# Altium schematic sheet CPU.SchDoc: Motherboard-CPU
size A3; Author: Patryk Bujak; DrawnBy: Patryk Bujak; Revision: 1.0; SheetNumber: 3; SheetTotal: 10
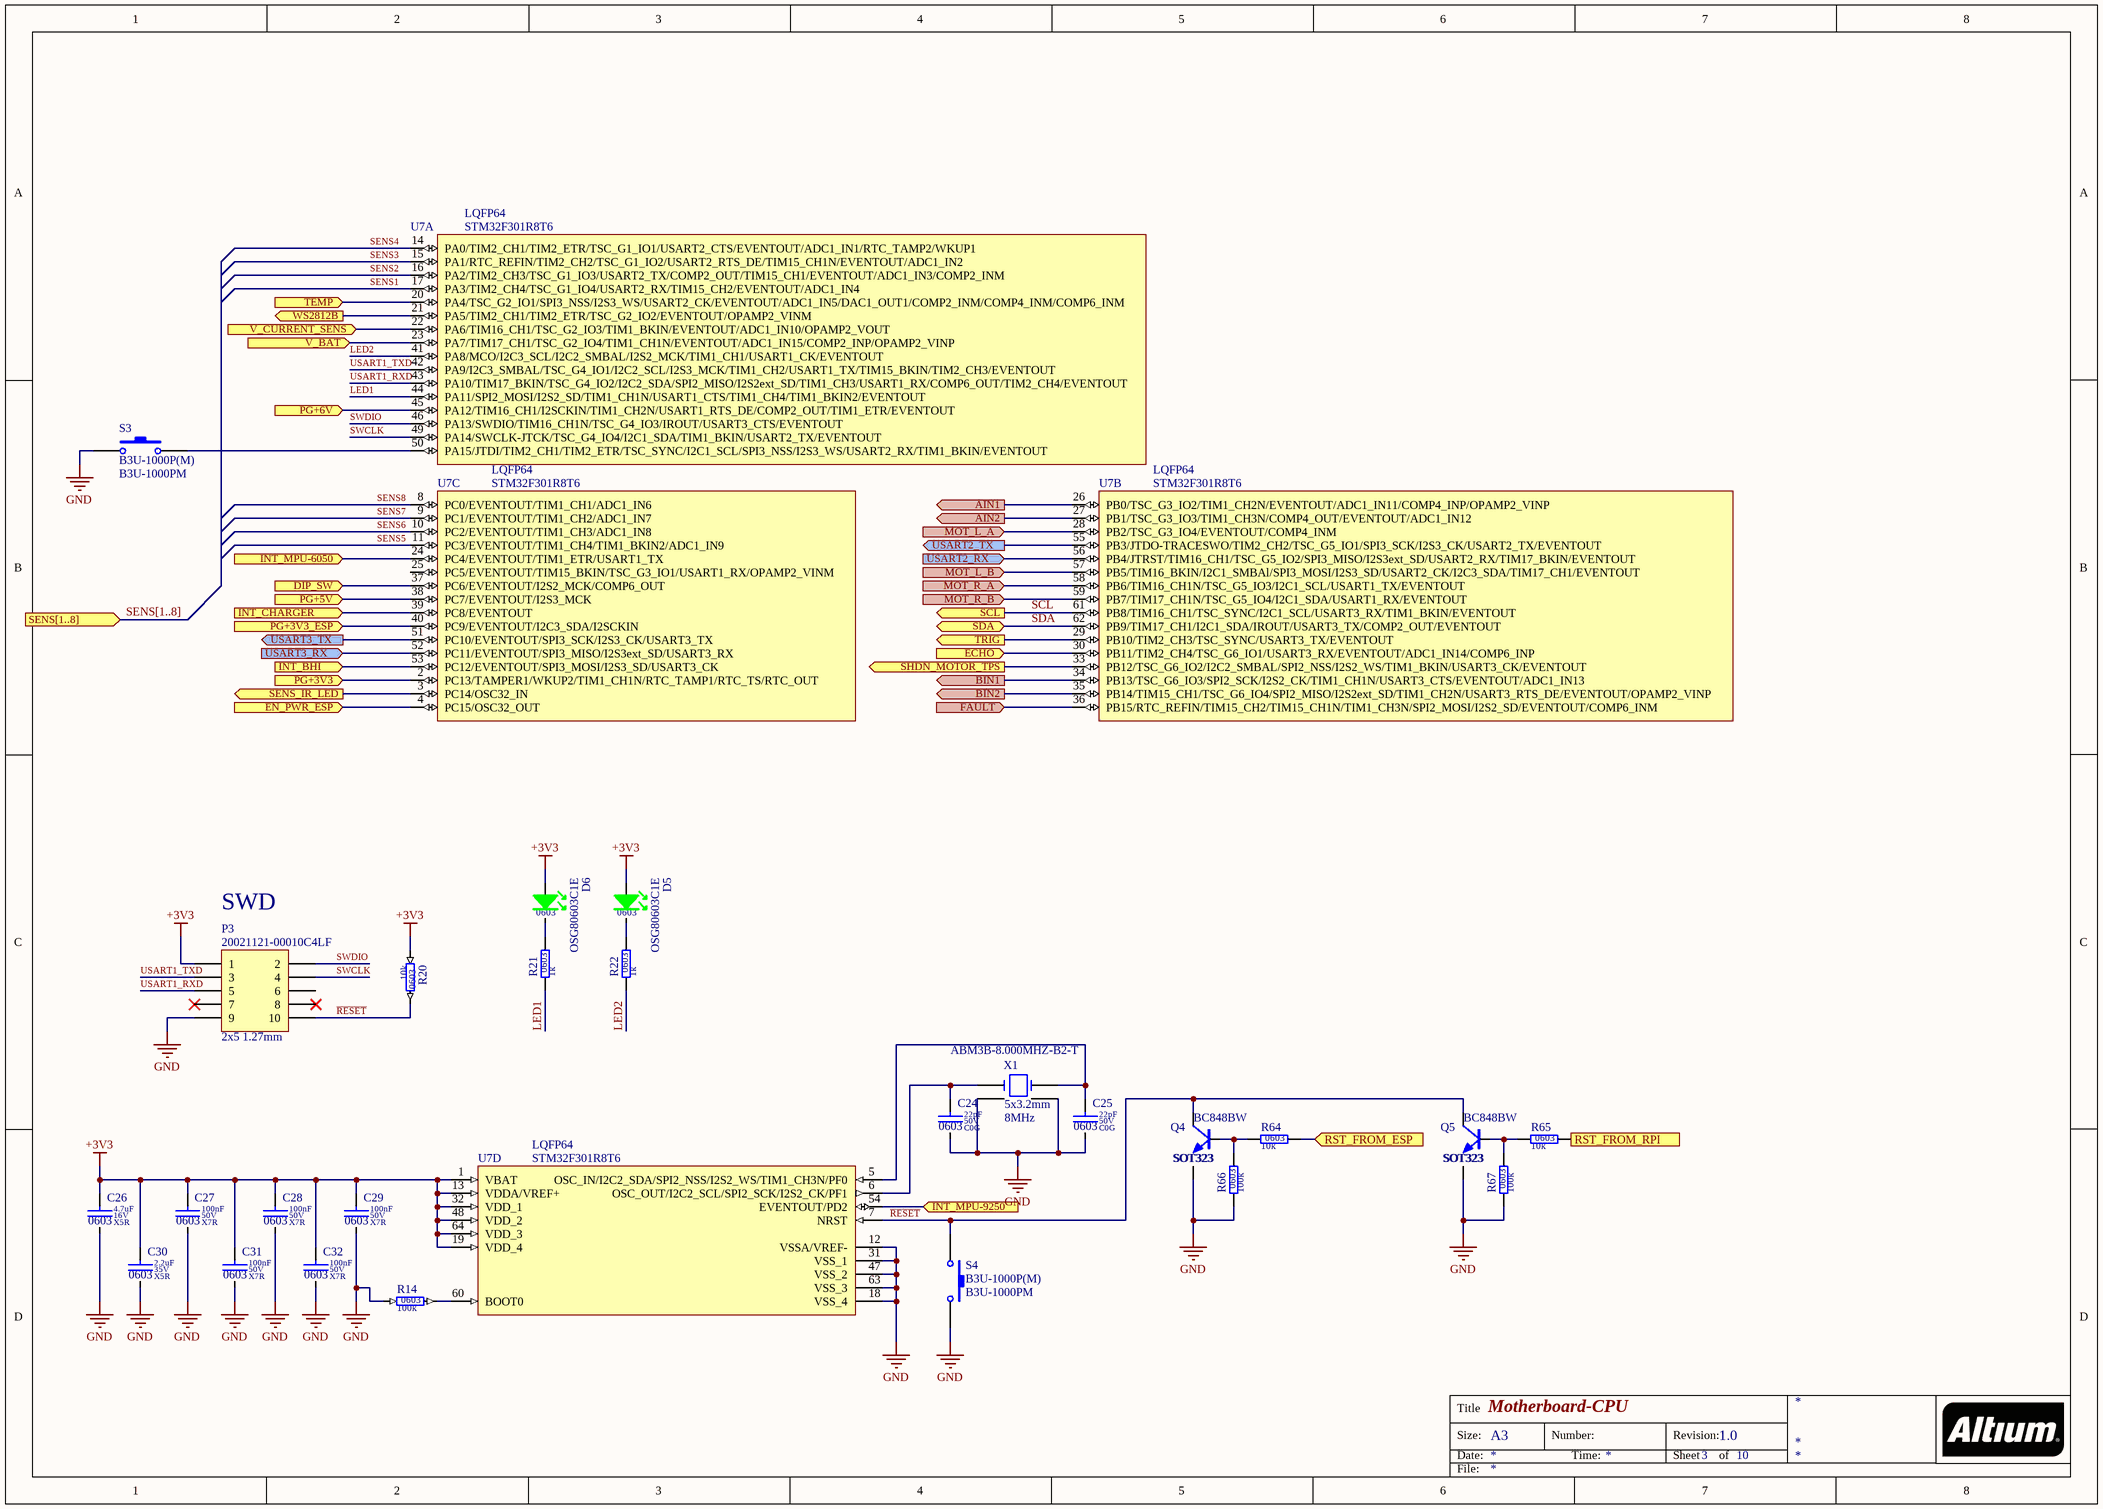
[diagram p0: CPU.SchDoc]

## Parts
C24  value 22pF  Dielectric: C0G  Voltage: 50V  SCH_Footprint: 0603  [C_0603_1608]  (hidden comment: Ceramic C0G)
C25  value 22pF  Dielectric: C0G  Voltage: 50V  SCH_Footprint: 0603  [C_0603_1608]  (hidden comment: Ceramic C0G)
C26  value 4.7uF  Dielectric: X5R  Voltage: 16V  SCH_Footprint: 0603  [C_0603_1608]  (hidden comment: Ceramic X5R)
C27  value 100nF  Dielectric: X7R  Voltage: 50V  SCH_Footprint: 0603  [C_0603_1608]  (hidden comment: Ceramic X7R)
C28  value 100nF  Dielectric: X7R  Voltage: 50V  SCH_Footprint: 0603  [C_0603_1608]  (hidden comment: Ceramic X7R)
C29  value 100nF  Dielectric: X7R  Voltage: 50V  SCH_Footprint: 0603  [C_0603_1608]  (hidden comment: Ceramic X7R)
C30  value 2.2uF  Dielectric: X5R  Voltage: 35V  SCH_Footprint: 0603  [C_0603_1608]  (hidden comment: Ceramic X5R)
C31  value 100nF  Dielectric: X7R  Voltage: 50V  SCH_Footprint: 0603  [C_0603_1608]  (hidden comment: Ceramic X7R)
C32  value 100nF  Dielectric: X7R  Voltage: 50V  SCH_Footprint: 0603  [C_0603_1608]  (hidden comment: Ceramic X7R)
D5  value OSG80603C1E  SCH_Footprint: 0603  [OL_0603_1608]  (hidden comment: Green led)
D6  value OSG80603C1E  SCH_Footprint: 0603  [OL_0603_1608]  (hidden comment: Green led)
P3  value 20021121-00010C4LF  SCH_Footprint: 2x5 1.27mm  [P_HEADER_2x5_1.27]  (hidden comment: Jtag)
Q4  SCH_Footprint: SOT323  [SOT323_SC70]  (hidden comment: BC848BW)
Q5  SCH_Footprint: SOT323  [SOT323_SC70]  (hidden comment: BC848BW)
R14  value 100k  SCH_Footprint: 0603  [R_0603_1608]  (hidden comment: Resistor)
R20  value 10k  SCH_Footprint: 0603  [R_0603_1608]  (hidden comment: Resistor)
R21  value 1k  SCH_Footprint: 0603  [R_0603_1608]  (hidden comment: Resistor)
R22  value 1k  SCH_Footprint: 0603  [R_0603_1608]  (hidden comment: Resistor)
R64  value 10k  SCH_Footprint: 0603  [R_0603_1608]  (hidden comment: Resistor)
R65  value 10k  SCH_Footprint: 0603  [R_0603_1608]  (hidden comment: Resistor)
R66  value 100k  SCH_Footprint: 0603  [R_0603_1608]  (hidden comment: Resistor)
R67  value 100k  SCH_Footprint: 0603  [R_0603_1608]  (hidden comment: Resistor)
S3  value B3U-1000PM  SCH_Footprint: B3U-1000P(M)  [B3U-1000P]  (hidden comment: Ultra-small Tactile Switch)
S4  value B3U-1000PM  SCH_Footprint: B3U-1000P(M)  [B3U-1000P]  (hidden comment: Ultra-small Tactile Switch)
U7  SCH_Footprint: LQFP64  [LQFP64_10x10]  (hidden comment: STM32F301R8T6)  (parts A,B,C,D of 4)
X1  Manufacturer Part Number: ABM3B-8.000MHZ-B2-T  SCH_Footprint: 5x3.2mm  [X_ABM3B_5X3X11]  (hidden comment: 8MHz)

## Ports
AIN1 (out), AIN2 (out), BIN1 (out), BIN2 (out), DIP_SW (in), ECHO (in), EN_PWR_ESP (in), FAULT (in), INT_BHI (in), INT_CHARGER (in), INT_MPU-6050 (in), INT_MPU-9250 (in), MOT_L_A (in), MOT_L_B (in), MOT_R_A (in), MOT_R_B (in), PG+3V3 (in), PG+3V3_ESP (in), PG+5V (in), PG+6V (in), RST_FROM_ESP (in), RST_FROM_RPI (in), SCL (out), SDA (bidir), SENS[1..8] (in), SENS_IR_LED (out), SHDN_MOTOR_TPS (out), TEMP (in), TRIG (out), USART2_RX (in), USART2_TX (out), USART3_RX (in), USART3_TX (out), V_BAT (in), V_CURRENT_SENS (in), WS2812B (out)

## Nets
+3V3: C26.1 C27.1 C28.1 C29.1 C30.1 C31.1 C32.1 D5.2(A) D6.2(A) P3.1 R20.1 U7.1(VBAT) U7.13(VDDA/VREF+) U7.19(VDD_4) U7.32(VDD_1) U7.48(VDD_2) U7.64(VDD_3)
GND: C24.2 C25.2 C26.2 C27.2 C28.2 C29.2 C30.2 C31.2 C32.2 P3.9 Q4.2(E) Q5.2(E) R14.1 R66.1 R67.1 S3.1 S4.2 U7.12(VSSA/VREF-) U7.18(VSS_4) U7.31(VSS_1) U7.47(VSS_2) U7.63(VSS_3) X1.2(GND) X1.4(GND)
AIN1: U7.26(PB0/TSC_G3_IO2/TIM1_CH2N/EVENTOUT/ADC1_IN11/COMP4_INP/OPAMP2_VINP) ; port AIN1
AIN2: U7.27(PB1/TSC_G3_IO3/TIM1_CH3N/COMP4_OUT/EVENTOUT/ADC1_IN12) ; port AIN2
BIN1: U7.34(PB13/TSC_G6_IO3/SPI2_SCK/I2S2_CK/TIM1_CH1N/USART3_CTS/EVENTOUT/ADC1_IN13) ; port BIN1
BIN2: U7.35(PB14/TIM15_CH1/TSC_G6_IO4/SPI2_MISO/I2S2ext_SD/TIM1_CH2N/USART3_RTS_DE/EVENTOUT/OPAMP2_VINP) ; port BIN2
DIP_SW: U7.37(PC6/EVENTOUT/I2S2_MCK/COMP6_OUT) ; port DIP_SW
ECHO: U7.30(PB11/TIM2_CH4/TSC_G6_IO1/USART3_RX/EVENTOUT/ADC1_IN14/COMP6_INP) ; port ECHO
EN_PWR_ESP: U7.4(PC15/OSC32_OUT) ; port EN_PWR_ESP
FAULT: U7.36(PB15/RTC_REFIN/TIM15_CH2/TIM15_CH1N/TIM1_CH3N/SPI2_MOSI/I2S2_SD/EVENTOUT/COMP6_INM) ; port FAULT
INT_BHI: U7.53(PC12/EVENTOUT/SPI3_MOSI/I2S3_SD/USART3_CK) ; port INT_BHI
INT_CHARGER: U7.39(PC8/EVENTOUT) ; port INT_CHARGER
INT_MPU-6050: U7.24(PC4/EVENTOUT/TIM1_ETR/USART1_TX) ; port INT_MPU-6050
INT_MPU-9250: U7.54(EVENTOUT/PD2) ; port INT_MPU-9250
LED1: R21.1 U7.44(PA11/SPI2_MOSI/I2S2_SD/TIM1_CH1N/USART1_CTS/TIM1_CH4/TIM1_BKIN2/EVENTOUT)
LED2: R22.1 U7.41(PA8/MCO/I2C3_SCL/I2C2_SMBAL/I2S2_MCK/TIM1_CH1/USART1_CK/EVENTOUT)
MOT_L_A: U7.28(PB2/TSC_G3_IO4/EVENTOUT/COMP4_INM) ; port MOT_L_A
MOT_L_B: U7.57(PB5/TIM16_BKIN/I2C1_SMBAl/SPI3_MOSI/I2S3_SD/USART2_CK/I2C3_SDA/TIM17_CH1/EVENTOUT) ; port MOT_L_B
MOT_R_A: U7.58(PB6/TIM16_CH1N/TSC_G5_IO3/I2C1_SCL/USART1_TX/EVENTOUT) ; port MOT_R_A
MOT_R_B: U7.59(PB7/TIM17_CH1N/TSC_G5_IO4/I2C1_SDA/USART1_RX/EVENTOUT) ; port MOT_R_B
PG+3V3: U7.2(PC13/TAMPER1/WKUP2/TIM1_CH1N/RTC_TAMP1/RTC_TS/RTC_OUT) ; port PG+3V3
PG+3V3_ESP: U7.40(PC9/EVENTOUT/I2C3_SDA/I2SCKIN) ; port PG+3V3_ESP
PG+5V: U7.38(PC7/EVENTOUT/I2S3_MCK) ; port PG+5V
PG+6V: U7.45(PA12/TIM16_CH1/I2SCKIN/TIM1_CH2N/USART1_RTS_DE/COMP2_OUT/TIM1_ETR/EVENTOUT) ; port PG+6V
~{RESET}: P3.10 Q4.3(C) Q5.3(C) R20.2 S4.1 U7.7(NRST)
RST_FROM_ESP: R64.2 ; port RST_FROM_ESP
RST_FROM_RPI: R65.2 ; port RST_FROM_RPI
SCL: U7.61(PB8/TIM16_CH1/TSC_SYNC/I2C1_SCL/USART3_RX/TIM1_BKIN/EVENTOUT) ; port SCL
SDA: U7.62(PB9/TIM17_CH1/I2C1_SDA/IROUT/USART3_TX/COMP2_OUT/EVENTOUT) ; port SDA
SENS1: U7.17(PA3/TIM2_CH4/TSC_G1_IO4/USART2_RX/TIM15_CH2/EVENTOUT/ADC1_IN4)
SENS2: U7.16(PA2/TIM2_CH3/TSC_G1_IO3/USART2_TX/COMP2_OUT/TIM15_CH1/EVENTOUT/ADC1_IN3/COMP2_INM)
SENS3: U7.15(PA1/RTC_REFIN/TIM2_CH2/TSC_G1_IO2/USART2_RTS_DE/TIM15_CH1N/EVENTOUT/ADC1_IN2)
SENS4: U7.14(PA0/TIM2_CH1/TIM2_ETR/TSC_G1_IO1/USART2_CTS/EVENTOUT/ADC1_IN1/RTC_TAMP2/WKUP1)
SENS5: U7.11(PC3/EVENTOUT/TIM1_CH4/TIM1_BKIN2/ADC1_IN9)
SENS6: U7.10(PC2/EVENTOUT/TIM1_CH3/ADC1_IN8)
SENS7: U7.9(PC1/EVENTOUT/TIM1_CH2/ADC1_IN7)
SENS8: U7.8(PC0/EVENTOUT/TIM1_CH1/ADC1_IN6)
SENS_IR_LED: U7.3(PC14/OSC32_IN) ; port SENS_IR_LED
SHDN_MOTOR_TPS: U7.33(PB12/TSC_G6_IO2/I2C2_SMBAL/SPI2_NSS/I2S2_WS/TIM1_BKIN/USART3_CK/EVENTOUT) ; port SHDN_MOTOR_TPS
SWCLK: P3.4 U7.49(PA14/SWCLK-JTCK/TSC_G4_IO4/I2C1_SDA/TIM1_BKIN/USART2_TX/EVENTOUT)
SWDIO: P3.2 U7.46(PA13/SWDIO/TIM16_CH1N/TSC_G4_IO3/IROUT/USART3_CTS/EVENTOUT)
TEMP: U7.20(PA4/TSC_G2_IO1/SPI3_NSS/I2S3_WS/USART2_CK/EVENTOUT/ADC1_IN5/DAC1_OUT1/COMP2_INM/COMP4_INM/COMP6_INM) ; port TEMP
TRIG: U7.29(PB10/TIM2_CH3/TSC_SYNC/USART3_TX/EVENTOUT) ; port TRIG
USART1_RXD: P3.5 U7.43(PA10/TIM17_BKIN/TSC_G4_IO2/I2C2_SDA/SPI2_MISO/I2S2ext_SD/TIM1_CH3/USART1_RX/COMP6_OUT/TIM2_CH4/EVENTOUT)
USART1_TXD: P3.3 U7.42(PA9/I2C3_SMBAL/TSC_G4_IO1/I2C2_SCL/I2S3_MCK/TIM1_CH2/USART1_TX/TIM15_BKIN/TIM2_CH3/EVENTOUT)
USART2_RX: U7.56(PB4/JTRST/TIM16_CH1/TSC_G5_IO2/SPI3_MISO/I2S3ext_SD/USART2_RX/TIM17_BKIN/EVENTOUT) ; port USART2_RX
USART2_TX: U7.55(PB3/JTDO-TRACESWO/TIM2_CH2/TSC_G5_IO1/SPI3_SCK/I2S3_CK/USART2_TX/EVENTOUT) ; port USART2_TX
USART3_RX: U7.52(PC11/EVENTOUT/SPI3_MISO/I2S3ext_SD/USART3_RX) ; port USART3_RX
USART3_TX: U7.51(PC10/EVENTOUT/SPI3_SCK/I2S3_CK/USART3_TX) ; port USART3_TX
V_BAT: U7.23(PA7/TIM17_CH1/TSC_G2_IO4/TIM1_CH1N/EVENTOUT/ADC1_IN15/COMP2_INP/OPAMP2_VINP) ; port V_BAT
V_CURRENT_SENS: U7.22(PA6/TIM16_CH1/TSC_G2_IO3/TIM1_BKIN/EVENTOUT/ADC1_IN10/OPAMP2_VOUT) ; port V_CURRENT_SENS
WS2812B: U7.21(PA5/TIM2_CH1/TIM2_ETR/TSC_G2_IO2/EVENTOUT/OPAMP2_VINM) ; port WS2812B
NetC24_1: C24.1 U7.6(OSC_OUT/I2C2_SCL/SPI2_SCK/I2S2_CK/PF1) X1.3
NetC25_1: C25.1 U7.5(OSC_IN/I2C2_SDA/SPI2_NSS/I2S2_WS/TIM1_CH3N/PF0) X1.1
NetD5_1: D5.1(K) R22.2
NetD6_1: D6.1(K) R21.2
NetQ4_1: Q4.1(B) R64.1 R66.2
NetQ5_1: Q5.1(B) R65.1 R67.2
NetR14_2: R14.2 U7.60(BOOT0)
NetS3_2: S3.2 U7.50(PA15/JTDI/TIM2_CH1/TIM2_ETR/TSC_SYNC/I2C1_SCL/SPI3_NSS/I2S3_WS/USART2_RX/TIM1_BKIN/EVENTOUT)

Not connected (* = marked no-connect by the designer): P3 6 7* 8*; U7 25(PC5/EVENTOUT/TIM15_BKIN/TSC_G3_IO1/USART1_RX/OPAMP2_VINM)

## Buses and harness runs
bus SENS[1..8] = port SENS[1..8]

## Notes on the sheet
- (near P3) SWD
- Title
- Size:
- Date:
- A3
- Number:
- Time:
- Revision:
- Sheet
- of
- File:

## Library data of the parts
C24 C25 = C_22pF_50V_C0G_0603_5: Capacitor; Manufacturer: AVX; Manufacturer Part Number: 06035A220JAT2A; Tolerance (%): 5; Part Number: C_22pF_50V_C0G_0603_5; HelpURL: https://datasheet.octopart.com/06035A220JAT2A-AVX-datasheet-9883399.pdf; Supplier 1: TME; Supplier 2: RS Components; Supplier Part Number 2: 1349628; Supplier 3: Farnell; Supplier Part Number 3: 2280861; Supplier 4: Mouser; Supplier Part Number 4: 581-06035A220J; Supplier 5: Digi-Key; Supplier Part Number 5: 478-1167-1-ND
C26 = C_4.7uF_16V_X5R_0603_10: Capacitor; Manufacturer: Murata; Manufacturer Part Number: GRM188R61C475KAAJD; Tolerance (%): 10; Part Number: C_4.7uF_16V_X5R_0603_10; HelpURL: https://datasheet.octopart.com/GRM188R61C475KAAJD-Murata-datasheet-66077093.pdf; Supplier 1: TME; Supplier 2: RS Components; Supplier Part Number 2: 884-7264P; Supplier 3: Farnell; Supplier Part Number 3: 2611924; Supplier 4: Mouser; Supplier Part Number 4: 81-GRM188R61C475KAJD; Supplier 5: Digi-Key; Supplier Part Number 5: 490-10481-2-ND
C27-C29 C31 C32 = C_100nF_50V_X7R_0603_5: Capacitor; Manufacturer: Samsung; Manufacturer Part Number: CL10B104JB8NNNC; Tolerance (%): 5; Part Number: C_100nF_50V_X7R_0603_5; HelpURL: http://www.tme.eu/pl/Document/4a42202b32dab16128fe107dd69598cc/samsung-chip-cap.pdf; Supplier 1: TME; Supplier Part Number 1: CL10B104JB8NNNC; Supplier 2: RS Components; Supplier 3: Farnell; Supplier 4: Mouser; Supplier 5: Digi-Key
C30 = C_2.2uF_35V_X5R_0603_10: Capacitor; Manufacturer: Murata; Manufacturer Part Number: GRM188R6YA225KA12D; Tolerance (%): 10; Part Number: C_2.2uF_35V_X5R_0603_10; HelpURL: https://datasheet.octopart.com/GRM188R6YA225KA12D-Murata-datasheet-66077095.pdf; Supplier 1: TME; Supplier 2: RS Components; Supplier Part Number 2: 8151358; Supplier 3: Farnell; Supplier Part Number 3: 2611926; Supplier 4: Mouser; Supplier Part Number 4: 81-GRM188R6YA225KA2D; Supplier 5: Digi-Key; Supplier Part Number 5: 490-7204-1-ND
D5 D6 = OL_G_0603_OSG80603C1E: LED GREEN; Manufacturer: Optosupply; Part Number: OL_G_0603_OSG80603C1E; Manufacturer Part Number: OSG80603C1E; Supplier 1: TME; Supplier Part Number 1: OSG80603C1E; Supplier 2: RS Components; Supplier 3: Farnell; Supplier 4: Mouser; Supplier 5: Digi-Key
P3 = P_HEADER_2x5_1.27: Header, 10-Pin, Dual row; Manufacturer: FCI; Part Number: P_HEADER_2x5_1.27; Component Type: Standard; HelpURL: http://www.mouser.com/catalog/645/usd/1591.pdf; Manufacturer Part Number: 20021121-00010C4LF; Supplier 1: TME; Supplier Part Number 1: 20021121-00010C4LF; Supplier 2: RS Components; Supplier Part Number 2: 794-4584; Supplier 3: Farnell; Supplier Part Number 3: 1865279; Supplier 4: Mouser; Supplier Part Number 4: 649-202112100010C4LF; Supplier 5: Digi-Key; Supplier Part Number 5: 609-3695-1-ND
Q4 Q5 = QNP_BC848BW_30V_0A1: Manufacturer: Diotec Semiconductor; Type: NPN; Voltage: 30V; Current: 0A1; Part Number: QNP_BC848BW_30V_0A1; Value: BC848BW; HelpURL: http://www.tme.eu/pl/Document/6f749a16562a2a0770a5550dd3f478bf/bc846w.pdf; Manufacturer Part Number: BC848BW; Supplier 1: TME; Supplier Part Number 1: BC848BW-DIO; Supplier 2: RS Components; Supplier 3: Farnell; Supplier 4: Mouser; Supplier 5: Digi-Key
R14 R66 R67 = R_100k_0603_1: Manufacturer: Royalohm; Manufacturer Part Number: 0603SAF1003T5E; Voltage: 50V; Power: 100mW; Tolerance: 1%; Part Number: R_100k_0603_1; HelpURL: http://www.tme.eu/pl/Document/b315665a56acbc42df513c99b390ad98/ROYALOHM-THICKFILM.pdf; Supplier 1: TME; Supplier Part Number 1: SMD0603-100K-1%; Supplier 2: RS Components; Supplier 3: Farnell; Supplier 4: Mouser; Supplier Part Number 4: 667-ERJ-3EKF1003V; Supplier 5: Digi-Key; Supplier Part Number 5: P100KHCT-ND
R20 R64 R65 = R_10k_0603_1: Manufacturer: Vishay; Manufacturer Part Number: CRCW060310K0FKTABC; Voltage: 75V; Power: 100mW; Tolerance: 1%; Part Number: R_10k_0603_1; HelpURL: http://www.tme.eu/pl/Document/622e28308c06d160637f2b14751ba16b/Data%20Sheet%20CRCW_BCe3.pdf; Supplier 1: TME; Supplier Part Number 1: CRCW060310K0FKTABC; Supplier 2: RS Components; Supplier 3: Farnell; Supplier 4: Mouser; Supplier Part Number 4: 667-ERJ-3EKF1002V; Supplier 5: Digi-Key; Supplier Part Number 5: P10KGCT-ND
R21 R22 = R_1k_0603_1: Manufacturer: Vishay; Manufacturer Part Number: CRCW06031K00FKEA; Voltage: 75V; Power: 100mW; Tolerance: 1%; Part Number: R_1k_0603_1; HelpURL: http://www.farnell.com/datasheets/2310790.pdf?_ga=2.256888843.1690599162.1548417389-1379097396.1542296996&_gac=1.262631934.1547230258.Cj0KCQiAmuHhBRD0ARIsAFWyPwhX8HcvXnM3tA0ZBodZLzDIjH2ZxLpjT5LWo9bad_HPRbU8LfPq44UaAhEwEALw_wcB; Supplier 1: TME; Supplier 2: RS Components; Supplier Part Number 2: 678-9875P; Supplier 3: Farnell; Supplier Part Number 3: 1469740; Supplier 4: Mouser; Supplier Part Number 4: 71-CRCW0603-1.0K-E3; Supplier 5: Digi-Key; Supplier Part Number 5: 541-1.00KHCT-ND
S3 S4 = S_B3U-1000PM: Tact Switch; Manufacturer: OMRON; Part Number: S_B3U-1000PM; HelpURL: https://www.tme.eu/Document/abdade7e1ca56d20235b5c747d7227eb/B3U.PDF; Manufacturer Part Number: B3U-1000PM; Supplier 1: TME; Supplier Part Number 1: B3U-1000PM; Supplier 2: RS Components; Supplier 3: Farnell; Supplier 4: Mouser; Supplier Part Number 4: 653-B3U-1000PM; Supplier 5: Digi-Key
U7 = UP_STM32F301R8T6: Manufacturer: STMicroelectronics; Value: STM32F301R8T6; Part Number: UP_STM32F301R8T6; HelpURL: https://www.st.com/resource/en/datasheet/stm32f301c6.pdf; Manufacturer Part Number: STM32F301R8T6; Supplier 1: TME; Supplier 2: RS Components; Supplier 3: Farnell; Supplier Part Number 3: 2424416; Supplier 4: Mouser; Supplier Part Number 4: 511-STM32F301R8T6; Supplier 5: Digi-Key; Supplier Part Number 5: 497-17413-ND
X1 = X_ABM3B-8.000MHZ-B2-T: Manufacturer: Abracon; Part Number: X_ABM3B-8.000MHZ-B2-T; Value: 8MHz; HelpURL: https://datasheet.octopart.com/ABM3B-8.000MHZ-B2-T-Abracon-datasheet-12510201.pdf; Supplier 1: TME; Supplier Part Number 1: ABM3B-8.000MHZ-B2; Supplier 2: RS Components; Supplier Part Number 2: 171-0644; Supplier 3: Farnell; Supplier Part Number 3: 2467818; Supplier 4: Mouser; Supplier Part Number 4: 815-ABM3B-8.0-B2-T; Supplier 5: Digi-Key; Supplier Part Number 5: 535-9720-1-ND